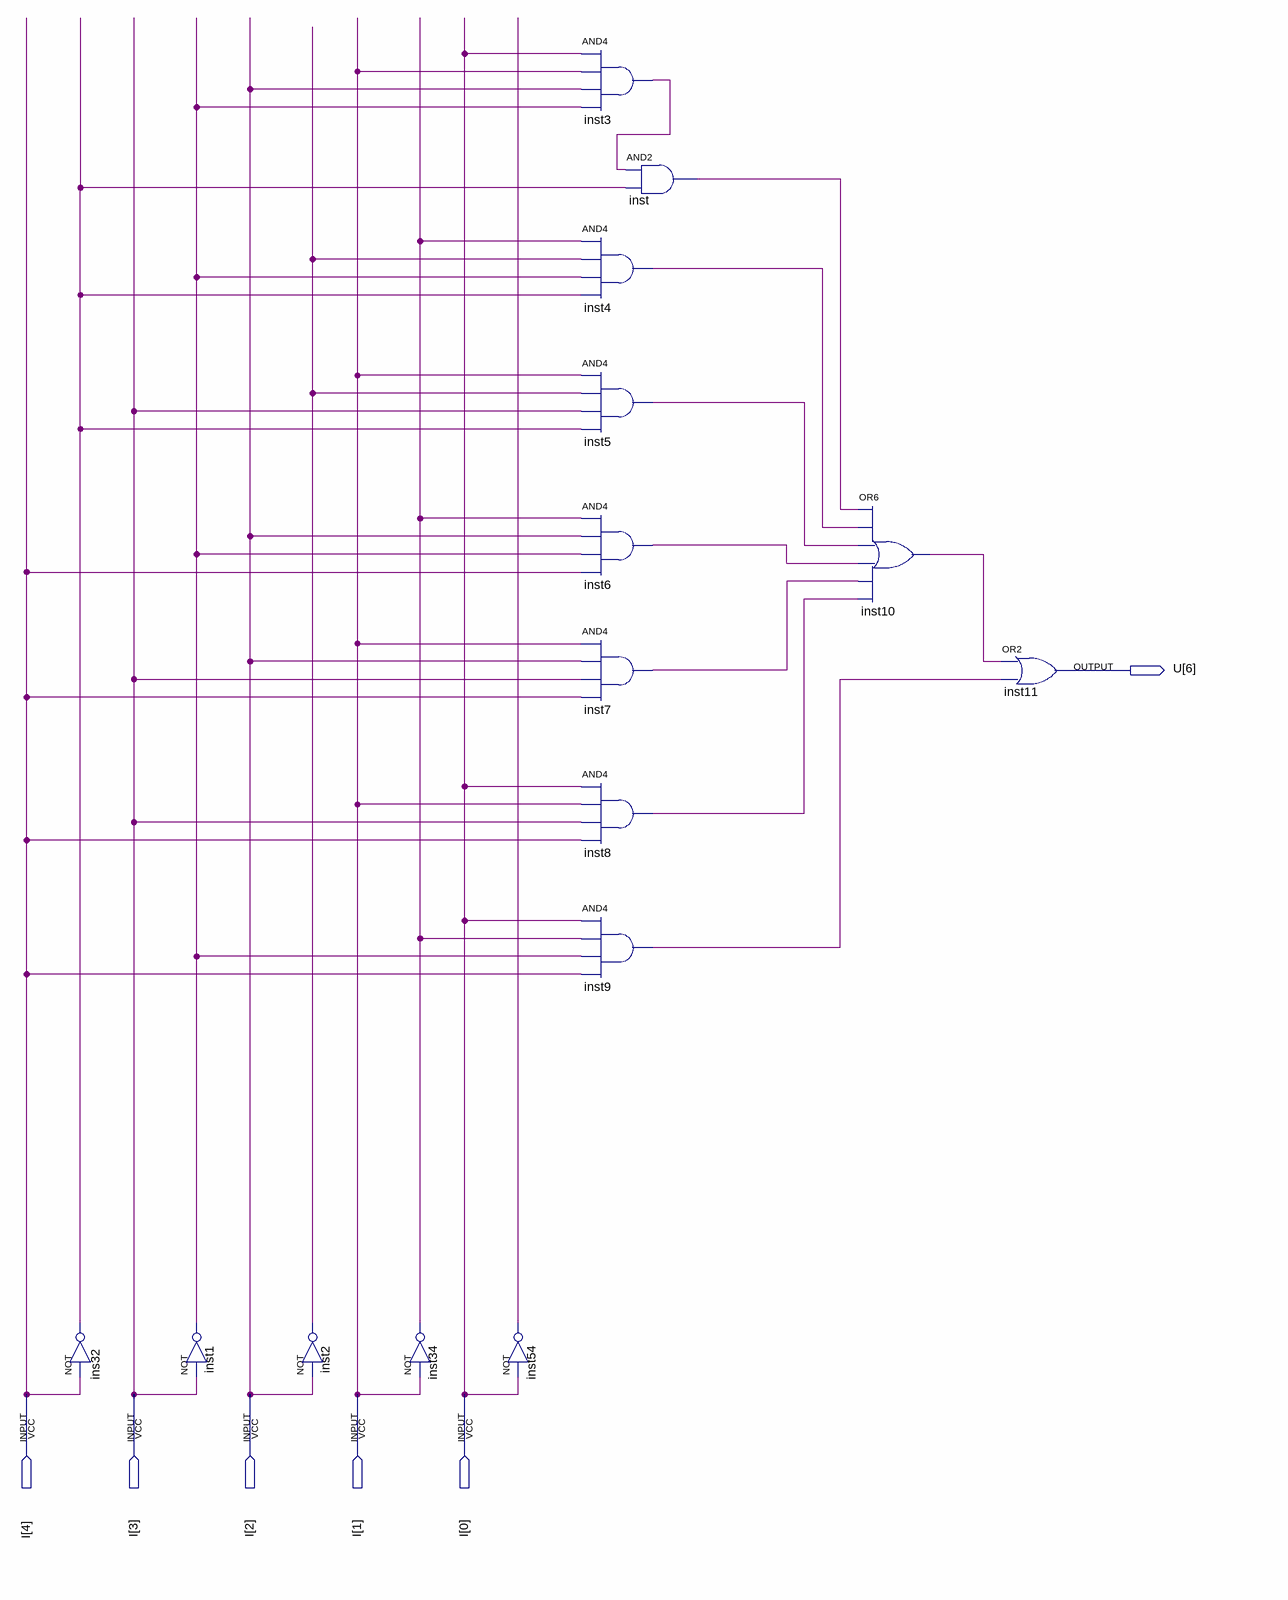
[diagram p0: schematic sheet]
// Quartus schematic BCD_g_Segment.bdf as structural Verilog: 15 symbols, 6 pins
module BCD_g_Segment (
  input  [4:0] I,
  output [6:6] U
);

  wire ins32_out, inst1_out, inst2_out, inst3_out, inst4_out, inst5_out, inst6_out, inst7_out, inst8_out,
       inst9_out, inst10_out, inst34_out, inst54_out, inst_out;

  not ins32 (ins32_out, I[4]);
  not inst1 (inst1_out, I[3]);
  not inst2 (inst2_out, I[2]);
  not inst34 (inst34_out, I[1]);
  not inst54 (inst54_out, I[0]);
  and inst3 (inst3_out, I[0], I[1], I[2], inst1_out);
  and inst4 (inst4_out, inst34_out, inst2_out, inst1_out, ins32_out);
  and inst5 (inst5_out, I[1], inst2_out, I[3], ins32_out);
  and inst6 (inst6_out, inst34_out, I[2], inst1_out, I[4]);
  and inst7 (inst7_out, I[1], I[2], I[3], I[4]);
  and inst8 (inst8_out, I[0], I[1], I[3], I[4]);
  and inst9 (inst9_out, I[0], inst34_out, inst1_out, I[4]);
  and inst (inst_out, inst3_out, ins32_out);
  or inst10 (inst10_out, inst_out, inst4_out, inst5_out, inst6_out, inst7_out, inst8_out);
  or inst11 (U[6], inst10_out, inst9_out);
endmodule
